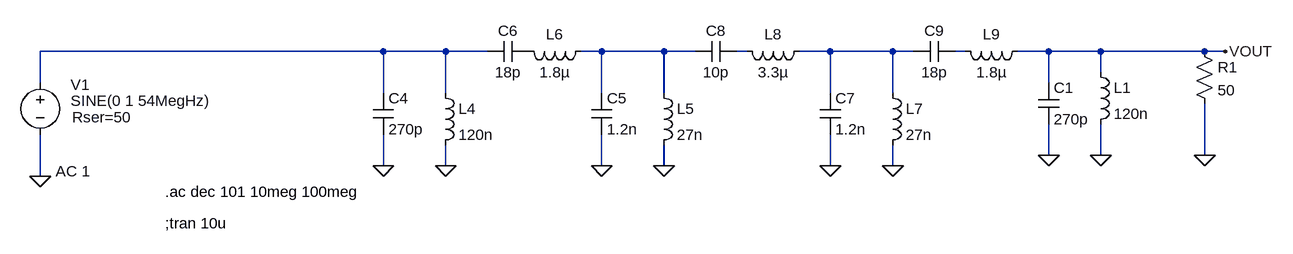
[diagram p0: schematic ETSI_BPF_only.asc]
ETSI_BPF_only.asc, the LTspice schematic file:
Version 4
SHEET 1 2560 680
WIRE 1184 128 656 128
WIRE 1280 128 1184 128
WIRE 1344 128 1280 128
WIRE 1520 128 1488 128
WIRE 1616 128 1520 128
WIRE 1664 128 1616 128
WIRE 1744 128 1728 128
WIRE 1872 128 1824 128
WIRE 1968 128 1872 128
WIRE 2000 128 1968 128
WIRE 2080 128 2064 128
WIRE 2208 128 2160 128
WIRE 2288 128 2208 128
WIRE 2448 128 2288 128
WIRE 2480 128 2448 128
WIRE 2288 160 2288 128
WIRE 656 176 656 128
WIRE 2208 176 2208 128
WIRE 1184 192 1184 128
WIRE 1280 192 1280 128
WIRE 1520 192 1520 128
WIRE 1616 192 1616 128
WIRE 1872 192 1872 128
WIRE 1968 192 1968 128
WIRE 2208 288 2208 240
WIRE 2288 288 2288 240
WIRE 2448 288 2448 208
WIRE 1184 304 1184 256
WIRE 1280 304 1280 272
WIRE 1520 304 1520 256
WIRE 1616 304 1616 272
WIRE 1872 304 1872 256
WIRE 1968 304 1968 272
WIRE 656 320 656 256
FLAG 2480 128 VOUT
FLAG 2448 288 0
FLAG 1184 304 0
FLAG 1280 304 0
FLAG 1520 304 0
FLAG 1616 304 0
FLAG 1872 304 0
FLAG 1968 304 0
FLAG 656 320 0
FLAG 2208 288 0
FLAG 2288 288 0
SYMBOL res 2432 112 R0
SYMATTR InstName R1
SYMATTR Value 50
SYMBOL cap 1168 192 R0
SYMATTR InstName C4
SYMATTR Value 270p
SYMBOL cap 1504 192 R0
SYMATTR InstName C5
SYMATTR Value 1.2n
SYMBOL ind 1264 176 R0
SYMATTR InstName L4
SYMATTR Value 120n
SYMBOL ind 1600 176 R0
SYMATTR InstName L5
SYMATTR Value 27n
SYMBOL ind 1504 112 R90
WINDOW 0 5 56 VBottom 2
WINDOW 3 32 56 VTop 2
SYMATTR InstName L6
SYMATTR Value 1.8µ
SYMBOL cap 1408 112 R90
WINDOW 0 0 32 VBottom 2
WINDOW 3 32 32 VTop 2
SYMATTR InstName C6
SYMATTR Value 18p
SYMBOL cap 1856 192 R0
SYMATTR InstName C7
SYMATTR Value 1.2n
SYMBOL ind 1952 176 R0
SYMATTR InstName L7
SYMATTR Value 27n
SYMBOL ind 1840 112 R90
WINDOW 0 5 56 VBottom 2
WINDOW 3 32 56 VTop 2
SYMATTR InstName L8
SYMATTR Value 3.3µ
SYMBOL cap 1728 112 R90
WINDOW 0 0 32 VBottom 2
WINDOW 3 32 32 VTop 2
SYMATTR InstName C8
SYMATTR Value 10p
SYMBOL ind 2176 112 R90
WINDOW 0 5 56 VBottom 2
WINDOW 3 32 56 VTop 2
SYMATTR InstName L9
SYMATTR Value 1.8µ
SYMBOL cap 2064 112 R90
WINDOW 0 0 32 VBottom 2
WINDOW 3 32 32 VTop 2
SYMATTR InstName C9
SYMATTR Value 18p
SYMBOL voltage 656 160 R0
WINDOW 123 24 152 Left 2
WINDOW 39 49 69 Left 2
WINDOW 0 47 19 Left 2
WINDOW 3 47 44 Left 2
SYMATTR Value2 AC 1
SYMATTR SpiceLine Rser=50
SYMATTR InstName V1
SYMATTR Value SINE(0 1 54MegHz)
SYMBOL cap 2192 176 R0
SYMATTR InstName C1
SYMATTR Value 270p
SYMBOL ind 2272 144 R0
SYMATTR InstName L1
SYMATTR Value 120n
TEXT 848 344 Left 2 !.ac dec 101 10meg 100meg
TEXT 848 392 Left 2 !;tran 10u

The netlist it stands for:
* ETSI_BPF_only.asc
R1 VOUT 0 50
C4 N001 0 270p
C5 N002 0 1.2n
L4 N001 0 120n
L5 N002 0 27n
L6 N002 P001 1.8µ
C6 P001 N001 18p
C7 N004 0 1.2n
L7 N004 0 27n
L8 N004 N003 3.3µ
C8 N003 N002 10p
L9 VOUT N005 1.8µ
C9 N005 N004 18p
V1 N001 0 SINE(0 1 54MegHz) AC 1 Rser=50
C1 VOUT 0 270p
L1 VOUT 0 120n
.ac dec 101 10meg 100meg
;tran 10u
.backanno
.end